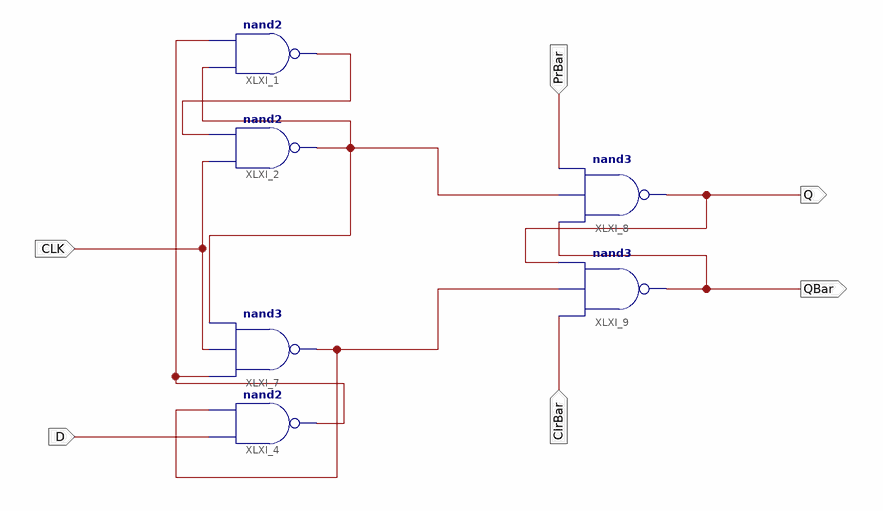
[diagram p0: schematic sheet 1]
// Xilinx ISE schematic D_Flip_Flop.sch (spartan3e) as structural Verilog: 6 symbols, 6 ports
module D_Flip_Flop (
  input  PrBar,
  input  ClrBar,
  input  CLK,
  input  D,
  output QBar,
  output Q
);

  wire XLXN_11, XLXN_12, XLXN_13, XLXN_16;

  nand XLXI_1 (XLXN_11, XLXN_12, XLXN_13);
  nand XLXI_2 (XLXN_12, CLK, XLXN_11);
  nand XLXI_4 (XLXN_13, D, XLXN_16);
  nand XLXI_7 (XLXN_16, XLXN_13, CLK, XLXN_12);
  nand XLXI_8 (Q, QBar, XLXN_12, PrBar);
  nand XLXI_9 (QBar, ClrBar, XLXN_16, Q);
endmodule
